# Altium project Lora_Z1_module.PrjPcb
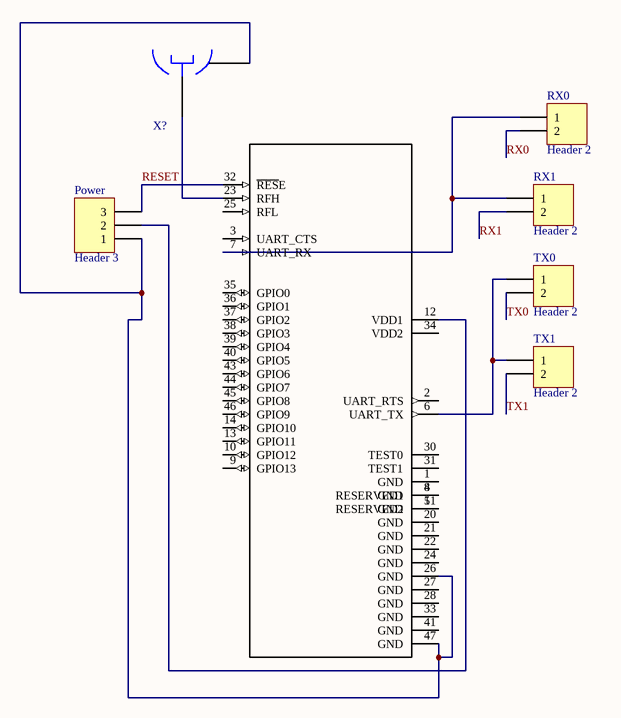
[diagram p0: Main.SchDoc]
1 sheet, 7 parts. Net scope: global (net labels, ports and power ports of the same name join across sheets).
Board file: Z1Shield.PcbDoc

## Sheet Main.SchDoc
size A4

### Parts
MODULE?  RN2483-I/RM095  [MICROCHIP_RN2483-I/RM095]  (value not drawn)
Power  Header 3  [HDR1X3]
RX0  Header 2  [JUMPER]
RX1  Header 2  [JUMPER]
TX0  Header 2  [JUMPER]
TX1  Header 2  [JUMPER]
X?  U.FL RF Connector  [U.FL]  (value not drawn)

### Nets
RESET: MODULE?.32(~{RES}E) Power.3
RX0: RX0.2
RX1: RX1.2
TX0: TX0.2
TX1: TX1.2
NetMODULE?_4: MODULE?.4(RESERVED1) MODULE?.8(GND)
NetMODULE?_5: MODULE?.5(RESERVED2) MODULE?.11(GND)
NetMODULE?_6: MODULE?.6(UART_TX) TX0.1 TX1.1
NetMODULE?_7: MODULE?.7(UART_RX) RX0.1 RX1.1
NetMODULE?_12: MODULE?.12(VDD1) Power.2
NetMODULE?_23: MODULE?.23(RFH) X?.1(+)
NetMODULE?_26: MODULE?.26(GND) MODULE?.47(GND) Power.1 X?.2(GND)

Not connected (* = marked no-connect by the designer): MODULE? 1(GND) 2(UART_RTS) 3(UART_CTS) 9(GPIO13) 10(GPIO12) 13(GPIO11) 14(GPIO10) 20(GND) 21(GND) 22(GND) 24(GND) 25(RFL) 27(GND) 28(GND) 30(TEST0) 31(TEST1) 33(GND) 34(VDD2) 35(GPIO0) 36(GPIO1) 37(GPIO2) 38(GPIO3) 39(GPIO4) 40(GPIO5) 41(GND) 43(GPIO6) 44(GPIO7) 45(GPIO8) 46(GPIO9)

### Library data of the parts
MODULE? = RN2483-I/RM095: Sub-GHz Dual Band Long Range Transceiver LoRa Module; MF: Microchip; Package: None; Price: 13.72 USD; MP: RN2483-I/RM095; Availability: Bad; Value: *
Power = Header 3: Header, 3-Pin; LatestRevisionDate: 17-Jul-2002; LatestRevisionNote: Re-released for DXP Platform.; Publisher: Altium Limited
RX0 RX1 TX0 TX1 = Header 2: Header, 2-Pin; LatestRevisionDate: 17-Jul-2002; LatestRevisionNote: Re-released for DXP Platform.; Publisher: Altium Limited
X? = AntennaOmnidirectional: CONN RF MICROCOAXIAL SMD GOLD; PartNumber: 73412-0110; Manufacturer: Molex; OrderCode1: WM5587CT-ND; UnitsPrice1: 1000; Mounted: Yes; Distributor1: Digikey; Price1: 0.27488; Class: Connector; Datasheet: http://www.molex.com/pdm_docs/sd/734120110_sd.pdf; SubClass: Connector